# EAGLE design parakeet_board_rev.1.0 (EAGLE 7.5.0)
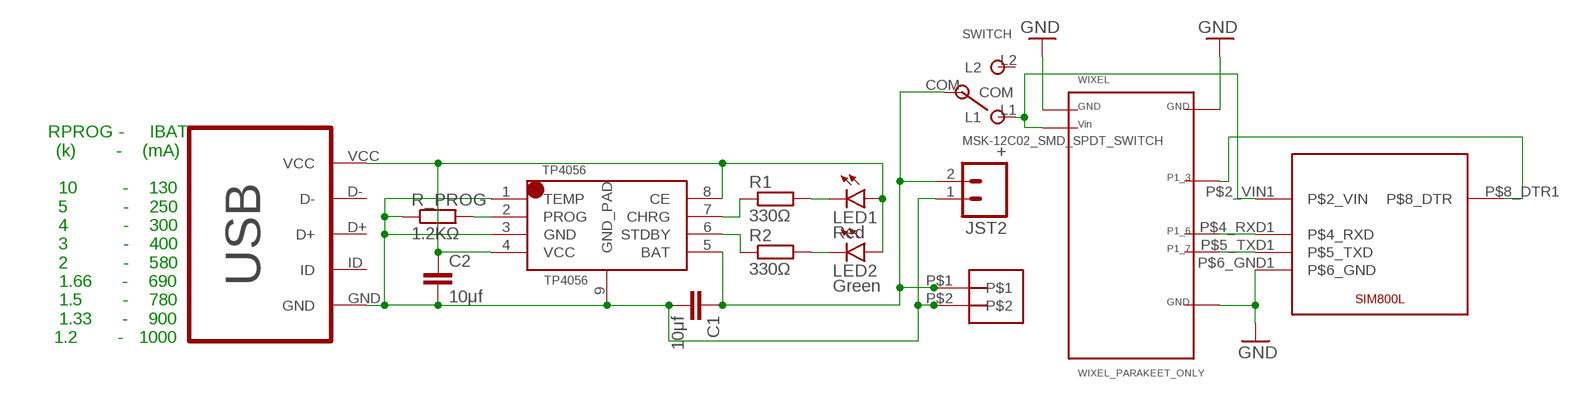
[diagram p0: schematic, sheet 1]

## Parts
C1  10μf  C-EUC1206  [C1206]
C2  10μf  C-EUC1206  [C1206]
JST2  +  M02-JST-2MM-SMT  [JST-2-SMD]
JST-XH  2_PIN_JST-XH-B2B  [2_PIN_JST-XH-B2B]
LED1  Red  LED1206  [LED-1206]
LED2  Green  LED1206  [LED-1206]
R1  330Ω  R-EU_R1206  [R1206]
R2  330Ω  R-EU_R1206  [R1206]
R_PROG  1.2KΩ  R-EU_R1206  [R1206]
SIM800L  SIM800L_PARAKEET_ONLY  [SIM800L_PARAKEET_ONLY]
SWITCH  MSK-12C02_SMD_SPDT_SWITCH  [MSK-12C02]
TP4056  TP4056  [SOP-8]
USB  MICRO-USB-B  [MICRO_USB_4_LEGS]
WIXEL  WIXEL_PARAKEET_ONLY  [WIXEL_PARAKEET_ONLY]

## Nets
GND: C1.2 C2.2 JST2.1 JST-XH.P$2 R_PROG.1 SIM800L.P$6_GND1(P$6_GND) TP4056.1(TEMP) TP4056.3(GND) TP4056.9(GND_PAD) USB.GND WIXEL.P$1(P$1-GND1) WIXEL.P$12(P$12-GND2) WIXEL.P$23(P$23-GND3)
N$1: R_PROG.2 TP4056.2(PROG)
N$2: SIM800L.P$5_TXD1(P$5_TXD) WIXEL.P$20(P$20-P1_7)
N$3: LED1.C R1.2
N$4: LED2.C R2.2
N$5: R1.1 TP4056.7(CHRG)
N$6: R2.1 TP4056.6(STDBY)
N$7: C2.1 LED1.A LED2.A TP4056.4(VCC) TP4056.8(CE) USB.VCC
N$8: C1.1 JST2.2 JST-XH.P$1 SWITCH.COM TP4056.5(BAT)
N$9: SIM800L.P$4_RXD1(P$4_RXD) WIXEL.P$19(P$19-P1_6)
N$12: SIM800L.P$2_VIN1(P$2_VIN) SWITCH.L1 WIXEL.P$2(P$2-VIN)
N$13: SIM800L.P$8_DTR1(P$8_DTR) WIXEL.P$16(P$16-P1_3)
Unconnected: SWITCH.L2 USB.D+ USB.D- USB.ID

## Notes on the sheet
- RPROG -     IBAT
  (k)        -    (mA)
  
  10         -    130
  5           -    250
  4           -    300
  3           -    400
  2           -    580
  1.66      -    690
  1.5        -    780
  1.33      -    900
  1.2        -   1000

## Library data of the parts
C1 C2 = resistor:C-EU: CAPACITOR, European symbol
JST2 = SparkFun-Connectors:M02: Standard 2-pin 0.1" header. Use with - straight break away headers ( PRT-00116) - right angle break away headers (PRT-00553) - swiss pins (PRT-00743) - machine pins (PRT-00117) - female headers (PRT-00115) Molex polarized connector foot print use with: PRT-08233 with associated crimp pins and housings. 2.54_SCREWTERM for use with PRT-10571. 3.5mm Screw Terminal footprints for PRT-08084 5mm Screw Terminal footprints for use with PRT-08432; PROD_ID: CONN-11443
JST-XH = JST-XH_HEADERS:2_PIN_JST-XH-B2B
LED1 LED2 = SparkFun-LED:LED: LEDs Standard schematic elements and footprints for 5mm, 3mm, 1206, and 0603 sized LEDs. 5mm - Spark Fun Electronics SKU : COM-00529 (and others)
R1 R2 R_PROG = resistor:R-EU_: RESISTOR, European symbol
SIM800L = SIM800L Module:SIM800L_PARAKEET_ONLY
SWITCH = MSK-12C02 SMD Micro Slider Switch SPDT:MSK-12C02_SMD_SPDT_SWITCH: Footprint of the VIMEX MSK-12C02 SPDT SMD Switch Created by mzst on 17-Jan-2016
TP4056 = TP4056:TP4056
USB = micro usb B - sparkfun - china - hole 4LEGS TEST:MICRO-USB-B
WIXEL = wixel:WIXEL_PARAKEET_ONLY

## Board
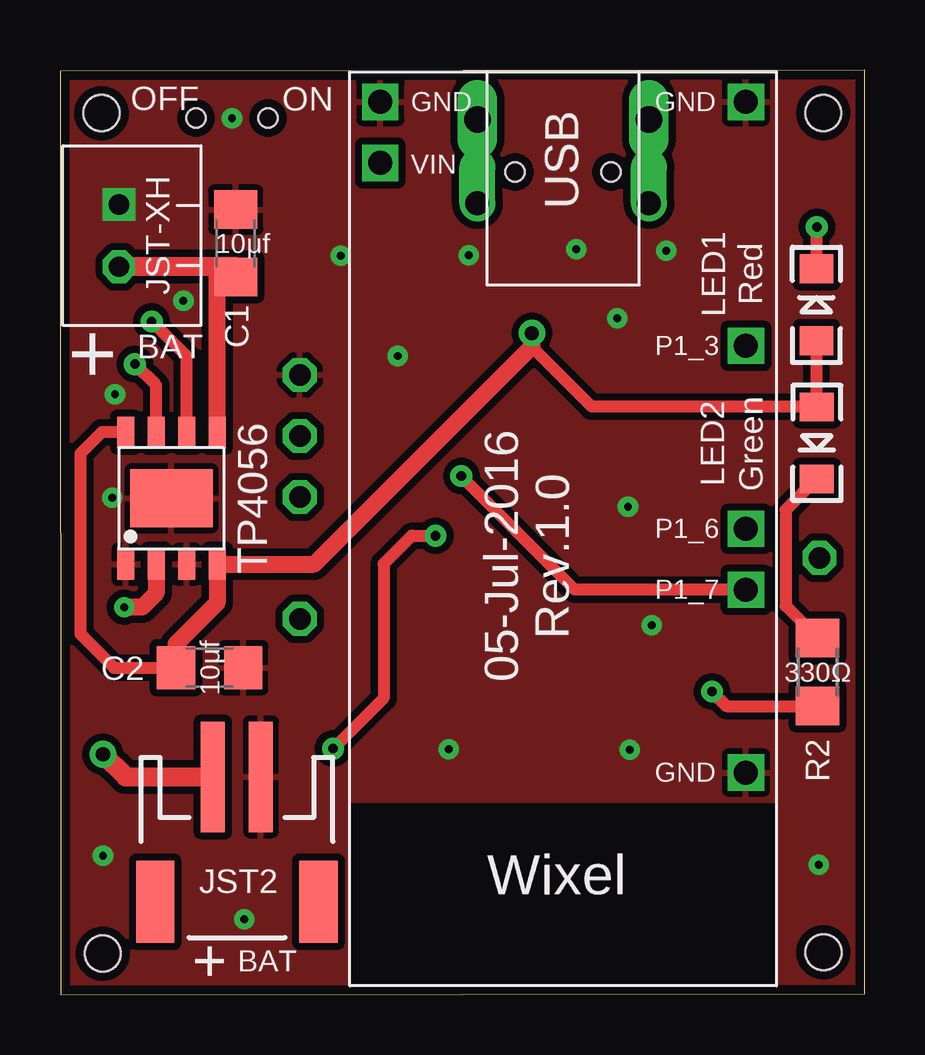
[diagram p1: board, top side]
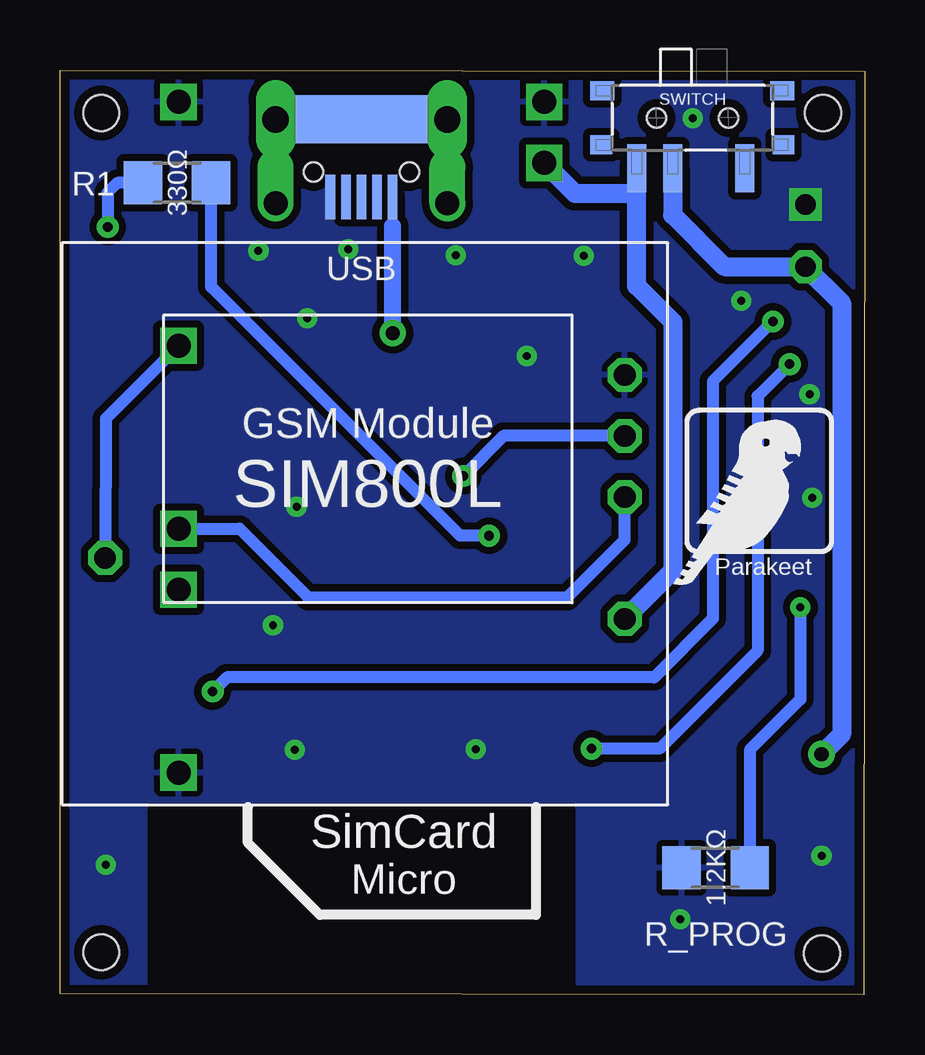
[diagram p2: board, bottom side, seen from below]

Size 33.52 x 38.52 mm. Coordinates in mm from the lower left corner, seen from the top.
Outline: 0.04,0 33.52,0.06 33.52,38.52 0,38.48 0.04,0
Copper layers (1*16): Top 0.0356mm / dielectric 1.5011mm / Bottom 0.0356mm
Design rules "LaenPCBOrderOSH *": minimum track width 6mil, minimum drill 13mil, track to track 6mil, track to pad 6mil, pad to pad 6mil, via to via 6mil, smd to smd 6mil, copper to edge 15mil, drill to drill 6mil, minimum pad ring 10mil, minimum via ring 10mil, stop-mask expansion 2.5mil, vias tented up to drill 25mil, thermal gap 10mil
Holes 1.5 mm at 1.78,1.72 31.81,1.78 31.8,36.75 1.72,36.74

### Footprints (pad centres in the part's own frame; a part is rotated, then mirrored left to right if it is on the bottom)
C1206 = smd 1.6 x 1.8: 1 -1.4,0; 2 1.4,0
JST-2-SMD = smd 1 x 4.6: 1 -1,-3.7; 2 1,-3.7 | smd 1.6 x 3.4: NC1 -3.4,1.5; NC2 3.4,1.5
2_PIN_JST-XH-B2B = drill 0.85 octagon: P$1 2.45,3.4 | drill 0.85 square: P$2 5.05,3.4
LED-1206 = smd 1.2 x 1.4: A -1.5,0; C 1.5,0
R1206 = smd 1.6 x 1.803: 1 -1.422,0; 2 1.422,0
SIM800L_PARAKEET_ONLY = drill 0.9 octagon: P$2_VIN1 1.8,15.66; P$4_RXD1 1.8,10.58; P$5_TXD1 1.8,8.04; P$6_GND1 1.8,5.5; P$8_DTR1 23.45,13.12
MSK-12C02 = smd 0.8 x 2: COM 0.823,2.1; L1 2.323,2.1; L2 -2.177,2.1 | smd 1 x 0.8: GND@1 -3.75,-1.125; GND@4 3.75,-1.125 | smd 0.9 x 0.8: GND@2 -3.8,1.125; GND@3 3.8,1.125 | hole 0.8: -1.5,0; 1.5,0
SOP-8 = smd 1.3 x 0.7: 1 -2.75,1.905; 2 -2.75,0.635; 3 -2.75,-0.635; 4 -2.75,-1.905; 5 2.75,-1.905; 6 2.75,-0.635; 7 2.75,0.635; 8 2.75,1.905 | smd 2.413 x 3.429: 9 0,0
MICRO_USB_4_LEGS = smd 1.85 x 0.4: D+ 3.125,0; D- 3.125,0.65; GND 3.125,-1.3; ID 3.125,-0.65; VCC 3.125,1.3 | drill 1.1 pad 1.5 long: P$1 -0.1,3.575; P$2 -0.1,-3.575 | drill 1 pad 1.5 offset: P$3 3.4,3.575; P$5 3.4,-3.575 | smd 2 x 6: P$4 -0.1,0 | hole 0.8: 2.1,2; 2.1,-2
WIXEL_PARAKEET_ONLY = drill 1 square: P$1 -7.62,16.51; P$2 -7.62,13.97; P$12 7.62,16.51; P$16 7.62,6.35; P$19 7.62,-1.27; P$20 7.62,-3.81 | drill 1 pad 1.422 square: P$23 7.62,-11.43

### Placement (x,y rotation side)
C1  7.33,31.32 90 top
C2  6.24,13.63 0 top
JST2  7.37,5.38 180 top
JST-XH  5.87,27.89 90 top
LED1  31.51,28.76 90 top
LED2  31.53,23 270 top
R1  28.65,33.84 180 bottom
R2  31.57,13.46 90 top
R_PROG  6.21,5.29 0 bottom
SIM800L  8.19,31.33 180 bottom
SWITCH  7.17,36.54 180 bottom
TP4056  4.64,20.69 90 top
U$2  [PARAKEET]  8,17 0 bottom
USB  20.96,36.38 270 bottom
WIXEL  20.96,20.69 0 top

### Tracks (layer width: path | path; a pad name or v marks a point on that pad's centre or on a via)
GND  (via drill 0.33)
  other vias: 25.25,31.01 21.52,31.07 11.7,30.81 17.04,30.83 7.17,36.53 5.14,28.93 2.29,25.03 2.18,20.72 7.67,3.15 23.74,10.22 24.65,15.4 23.67,20.34 23.22,28.2 14.07,26.62 16.2,10.24 31.61,5.42 1.79,5.8
  pour Top (isolate 0.305): -5.71,43.55 38.74,43.55 38.74,-4.71 -5.71,-4.71
  pour Bottom (isolate 0.305): -3.17,41.01 36.2,41.01 36.2,-2.17 -3.17,-2.17
N$1  (via drill 0.33)
  Top 0.7: TP4056.2 4.01,16.74 3.42,16.15 v2.67,16.15
  Bottom 0.5: v2.67,16.15 2.67,12.31 4.78,10.2 R_PROG.2
N$2  (via drill 0.4)
  Top 0.5: WIXEL.P$20 21.45,16.88 v16.72,21.62
  Bottom 0.5: SIM800L.P$5_TXD1 15.05,23.29 v16.72,21.62
N$3  (via drill 0.4)
  Top 0.5: v31.53,31.99 31.51,31.97 LED1.C
  Bottom 0.5: R1.2 31.13,33.84 31.53,33.44 v31.53,31.99
N$4
  Top 0.406: R2.2 31.57,14.79 31.12,14.34
  Top 0.5: R2.2 30.23,16.21 30.23,20.2 LED2.C
N$5  (via drill 0.4)
  Top 0.5: TP4056.7 4.01,25.39 v3.12,26.28 | v11.38,10.26 13.48,12.37 13.48,17.96 14.66,19.13 v15.65,19.13
  Bottom 0.5: v3.12,26.28 4.45,24.95 4.45,14.34 8.54,10.26 v11.38,10.26 | v15.65,19.13 16.86,19.13 27.23,29.5 R1.1
N$6  (via drill 0.4)
  Top 0.5: TP4056.6 5.28,26.6 v3.82,28.06 | v27.16,12.64 27.77,12.03 R2.1
  Bottom 0.5: v3.82,28.06 6.32,25.56 6.32,15.68 8.77,13.23 26.57,13.23 v27.16,12.64
N$7  (via drill 0.58)
  Top 0.406: LED2.A 31.28,24.5
  Top 0.5: LED1.A 31.51,24.51 | 31.13,24.51 22.16,24.51 19.66,27.02 | TP4056.8 1.74,23.44 0.85,22.55 0.85,15.04 2.26,13.63 C2.1
  Top 0.61: TP4056.8 2.72,23.42
  Top 0.7: 31.51,24.51 LED2.A | 31.13,24.51 31.12,24.5 31.28,24.5 31.29,24.5 | v19.66,27.58 19.66,27.02 10.59,17.94 TP4056.4 6.55,16.34 4.84,14.63 C2.1
  Bottom 0.406: 19.66,32.03 USB.VCC
  Bottom 0.7: v19.66,27.58 19.66,27.72 19.66,32.03
N$8  (via drill 0.6)
  Top 0.7: TP4056.5 6.55,29.92 C1.1 7.33,30.34
  Top 0.8: v1.79,10.03 2.73,9.08 JST2.2 | 7.33,30.34 JST-XH.P$1
  Bottom 0.8: v1.79,10.03 0.96,10.85 0.96,28.83 JST-XH.P$1 5.84,30.34 7.99,32.5 SWITCH.COM
N$9
  Bottom 0.5: WIXEL.P$19 26.04,19.42 23.19,16.57 12.39,16.57 9.99,18.96 SIM800L.P$4_RXD1
N$10
  cutout Bottom: 29.85,0.37 29.85,7.99 12.07,7.99 12.07,0.37
N$11
  cutout Top: 29.85,0.37 12.07,0.37 12.07,7.99 29.85,7.99
N$12
  Bottom 0.8: 9.49,33.39 9.49,29.54 7.99,28.04 7.99,17.67 SIM800L.P$2_VIN1 | 9.49,33.39 SWITCH.L1 | WIXEL.P$2 12.07,33.39 9.49,33.39
N$13
  Bottom 0.5: WIXEL.P$16 31.62,24.01 SIM800L.P$8_DTR1

### Text on the board
tNames: OFF | ON | JST-XH | BAT | + | 05-Jul-2016 / Rev.1.0 | BAT